# EAGLE design Airbeamv0_01-rn4020 (EAGLE 7.4.0)
DATABASE: ./BOM/Airbeam-PARTSDB.csv
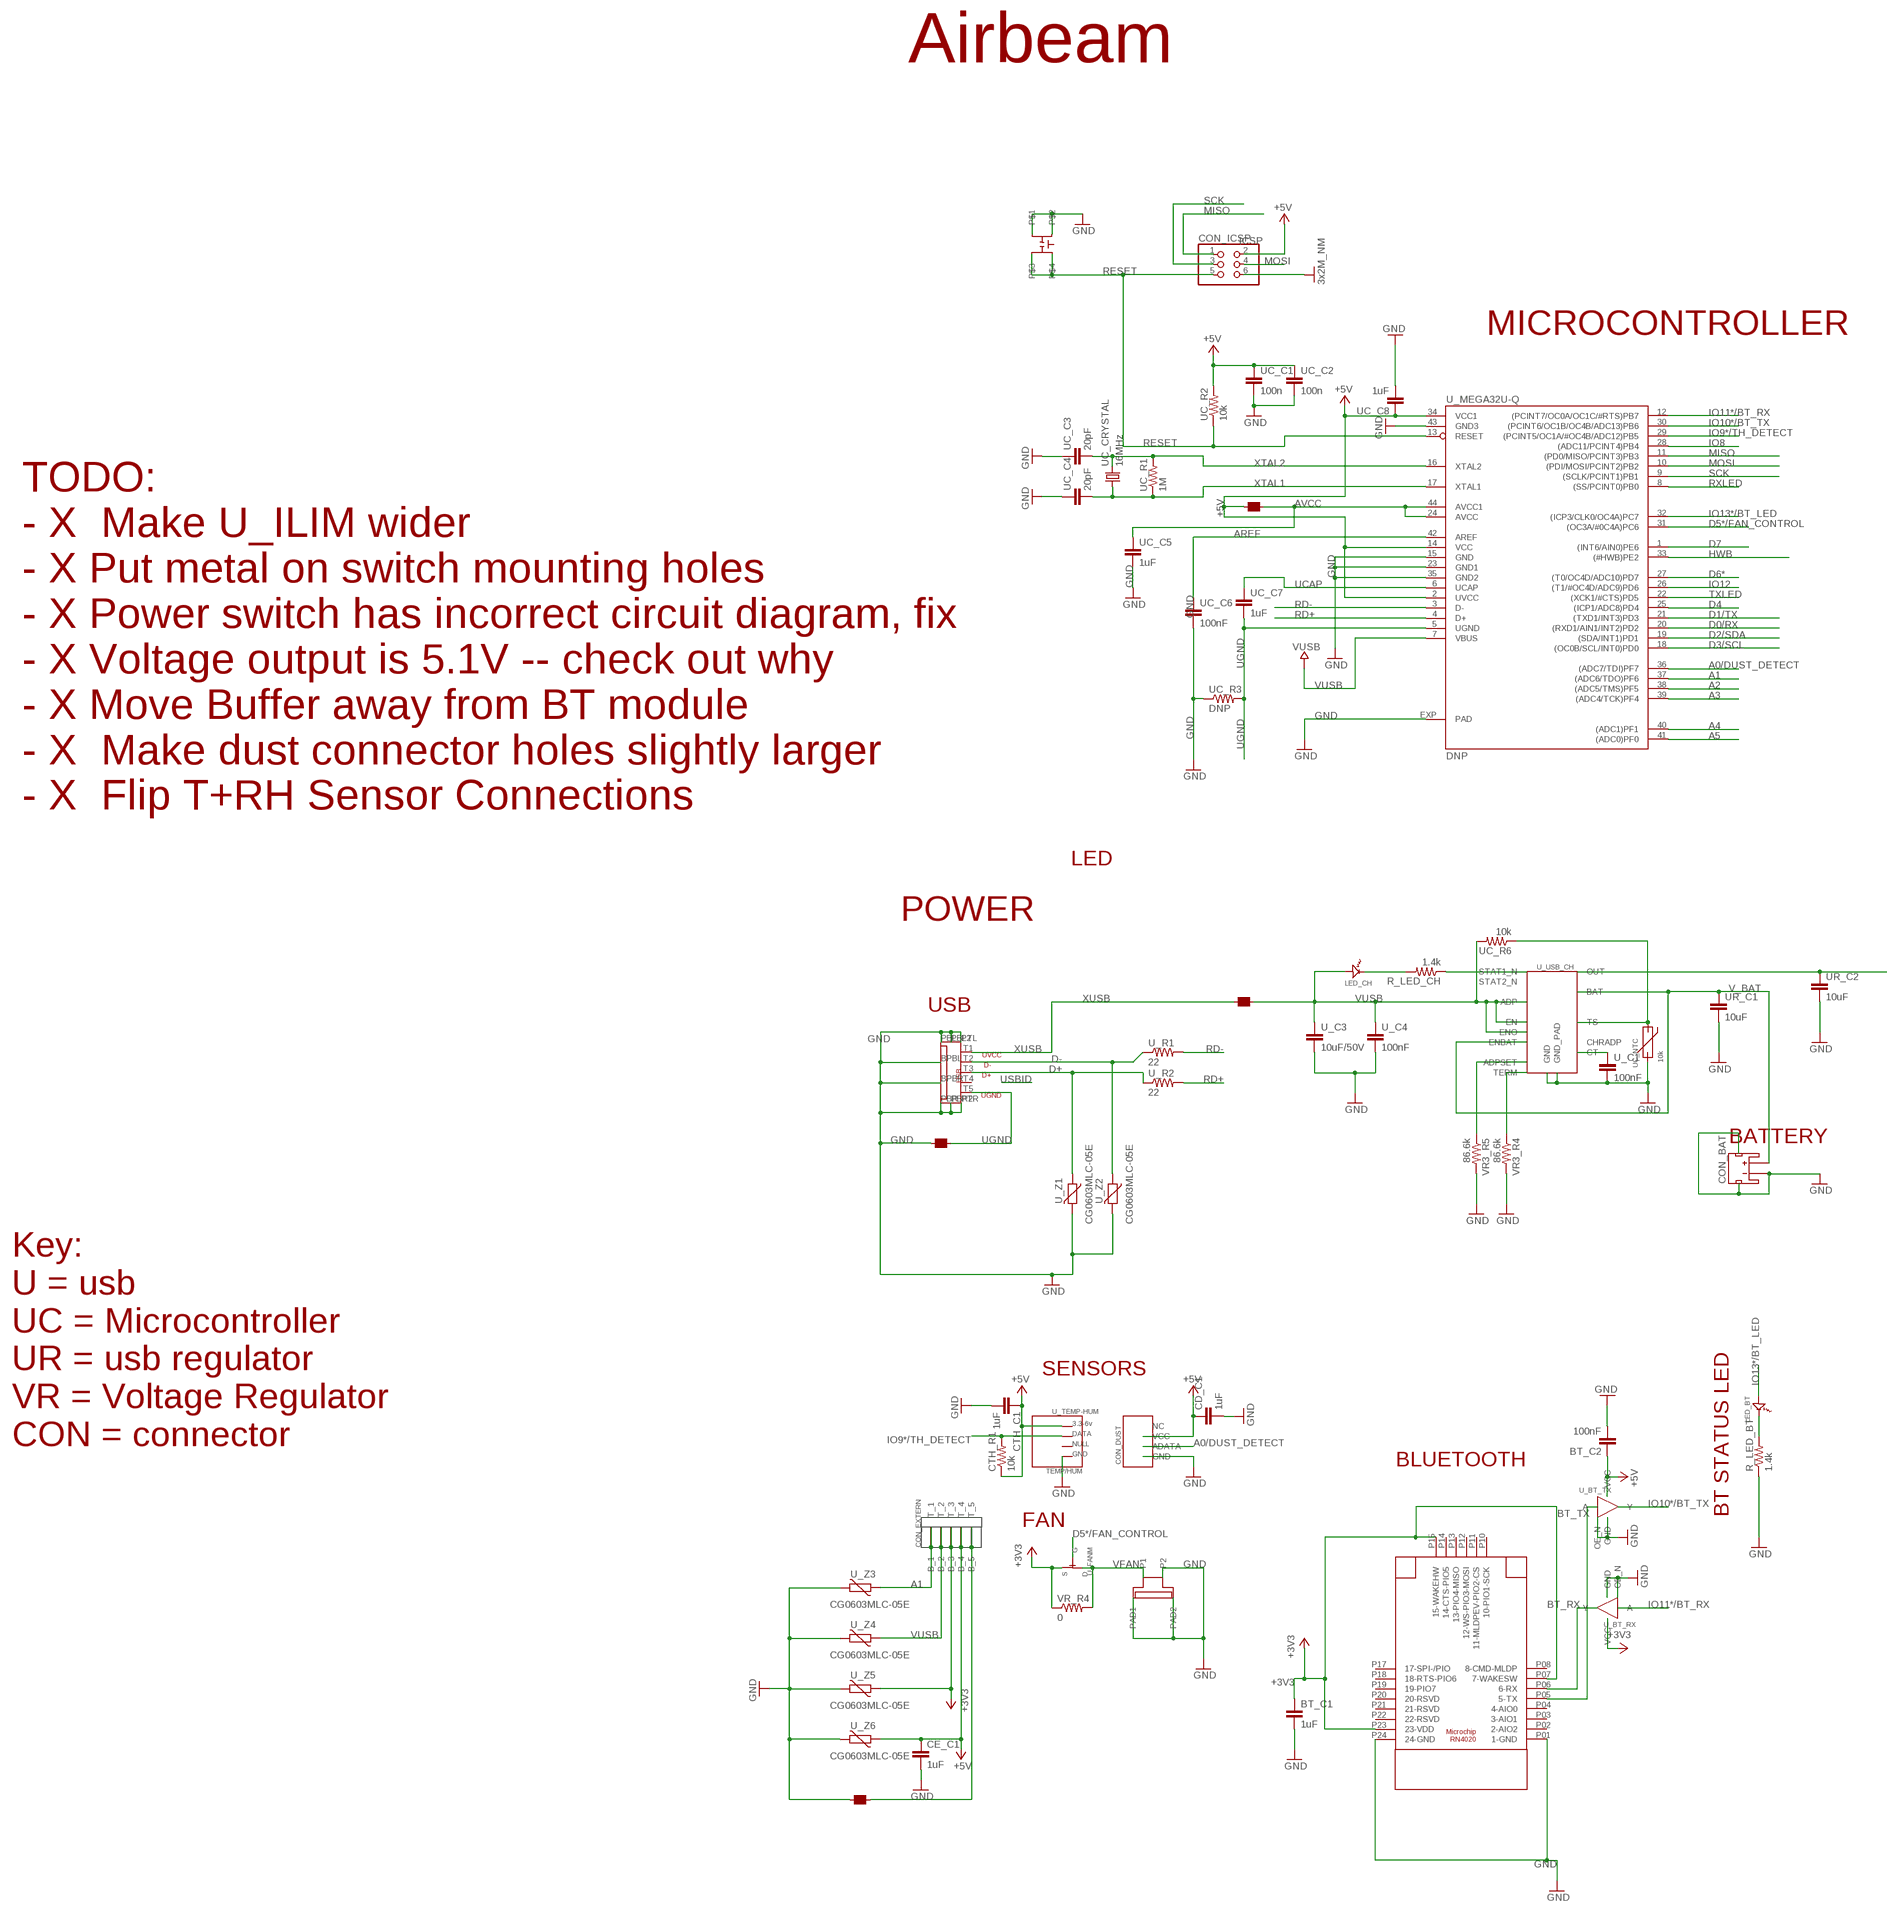
[diagram p0: schematic, sheet 1, part 1 of 2]
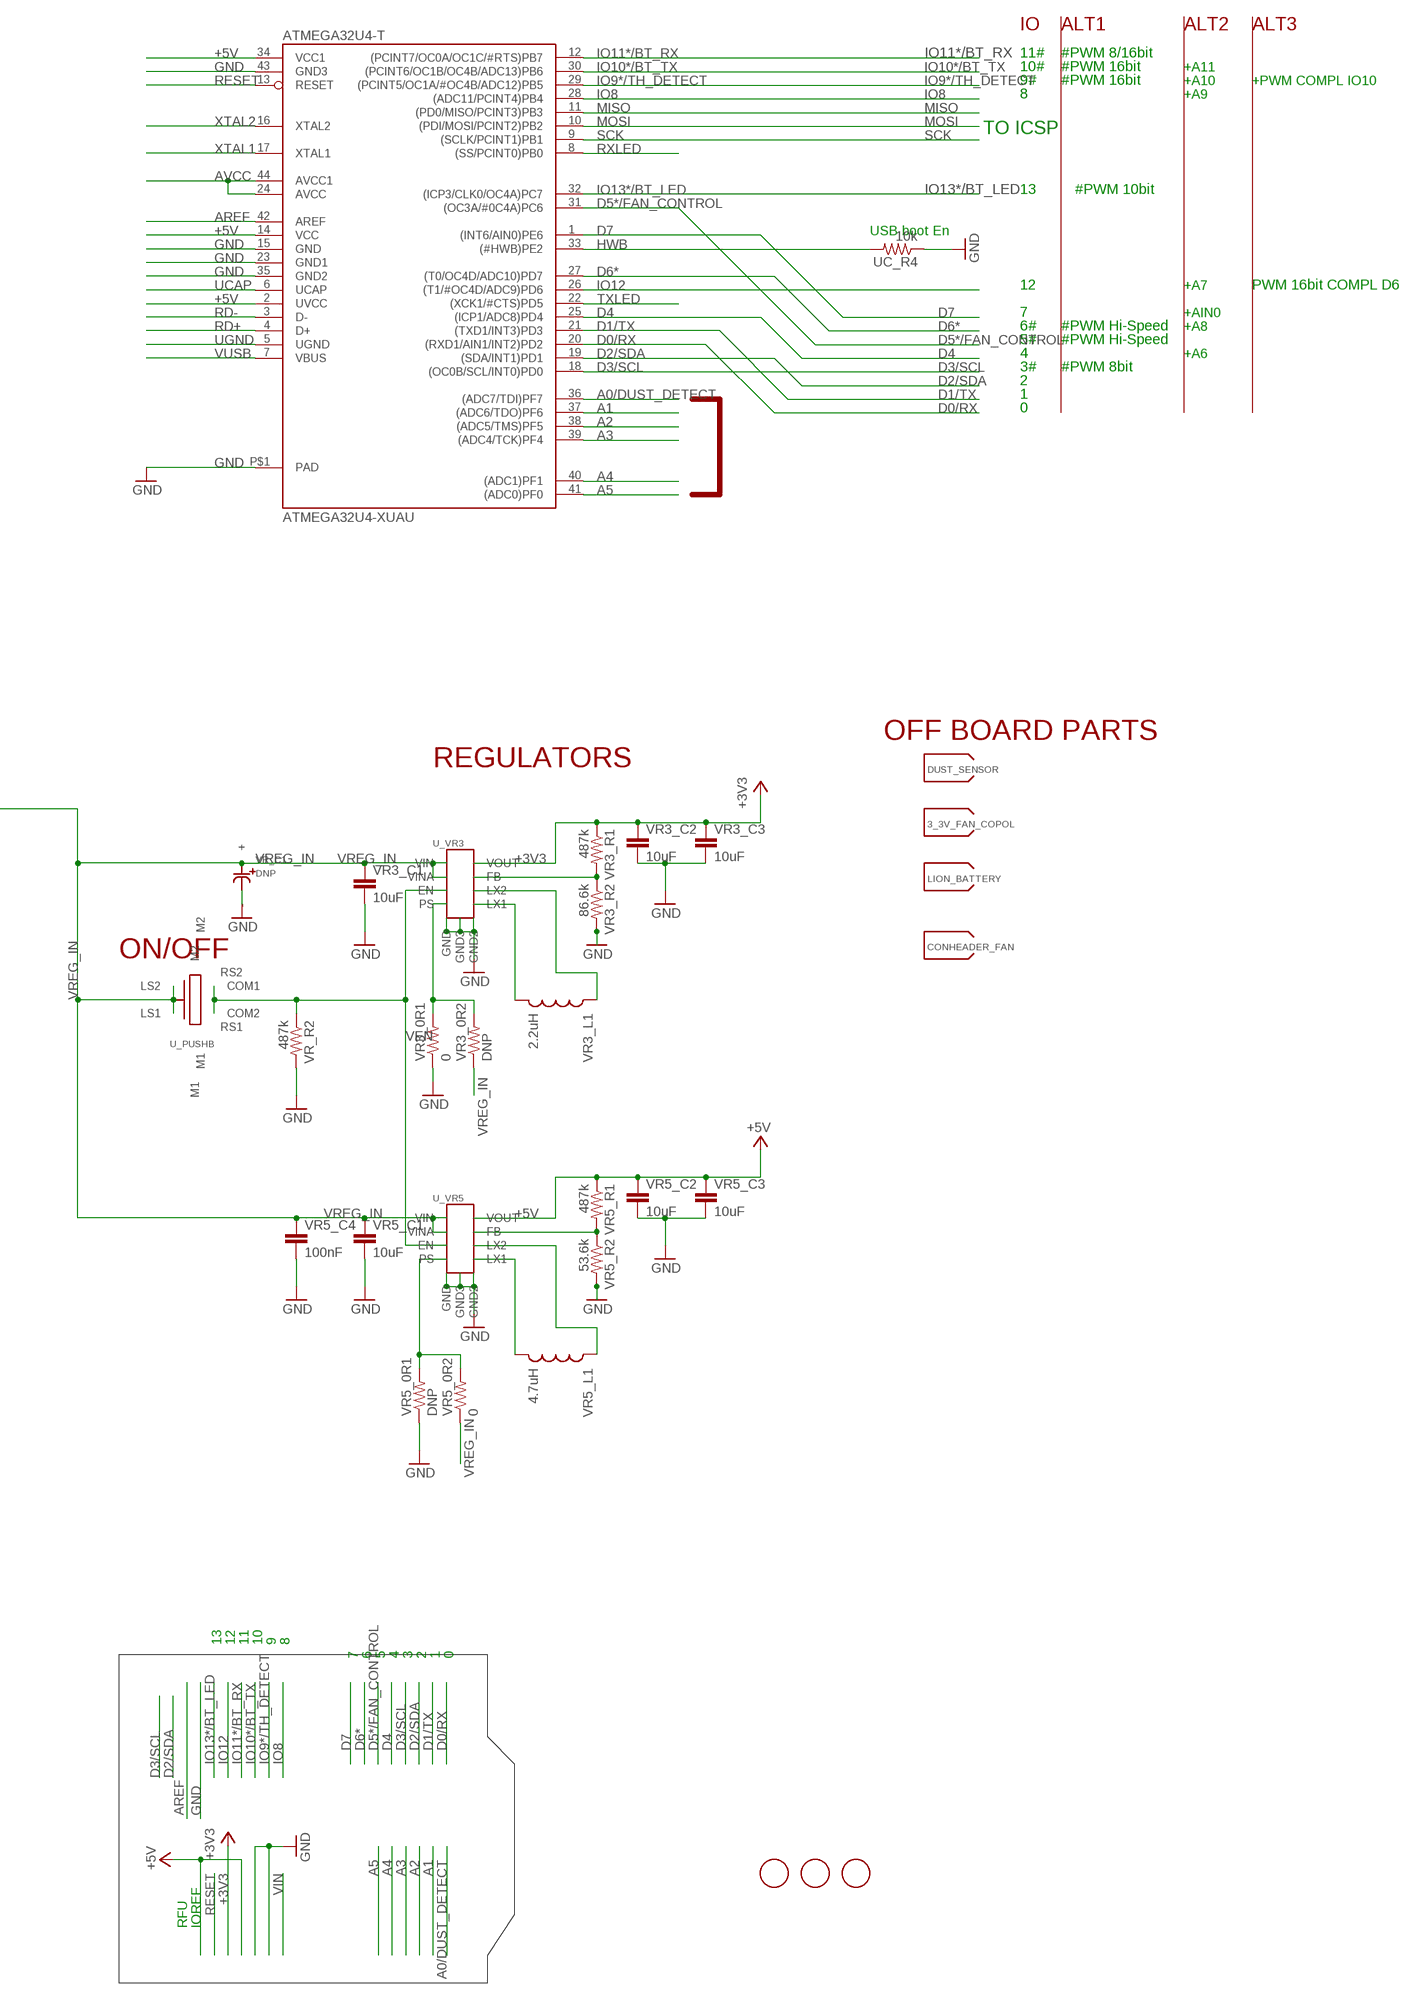
[diagram p1: schematic, sheet 1, part 2 of 2]

## Parts
3_3V_FAN_COPOL  OFF_BOARD  PART_OFFBOARD  [EMPTY]
ATMEGA32U4-T  ATMEGA32U4-XUAU  [TQFP44-PAD]
BT_C1  1uF  CAP0603-CAP  [0603-CAP]
BT_C2  100nF  CAP0603-CAP  [0603-CAP]
CA_FB1  FERITE_BEAD  [U_FB1]
CD_C1  1uF  CAP0603-CAP  [0603-CAP]
CE_C1  1uF  CAP0603-CAP  [0603-CAP]
CON_BAT  CON_BAT  JST_2MM_MALE  [JST-2-SMD]
CON_DUST  CON_DUST  [S4B-EH]
CON_EXTERN  TBLOCK_5  [TBLOCK_5]
CON_FAN  SUR_2PIN  [JST-0.8MM]
CON_ICSP  ICSP  PINHD-2X3  [2X03]
CON_USB  USB-FCI  [USB-FCI]
CONHEADER_FAN  OFF_BOARD  PART_OFFBOARD  [EMPTY]
CTH_C1  1uF  CAP0603-CAP  [0603-CAP]
CTH_R1  10k  RESISTOR0603-RES  [0603-RES]
DUST_SENSOR  OFF_BOARD  PART_OFFBOARD  [EMPTY]
FID1  FIDUCIALMOUNT  [FIDUCIA-MOUNT]
FID2  FIDUCIALMOUNT  [FIDUCIA-MOUNT]
FID3  FIDUCIALMOUNT  [FIDUCIA-MOUNT]
LED_BT  LED  [LED_550]
LED_CH  LED  [LED_550]
LION_BATTERY  OFF_BOARD  PART_OFFBOARD  [EMPTY]
R_LED_BT  1.4k  RESISTOR0603-RES  [0603-RES]
R_LED_CH  1.4k  RESISTOR0603-RES  [0603-RES]
RESET_SWITCH  DNP  SWITCH  [SWITCH_TACTILE]
U$1  RN4020  [RN4020SMD]
U_BT_RX  V_BUFFER  [SOT23-5]
U_BT_TX  V_BUFFER  [SOT23-5]
U_C1  100nF  CAP0603-CAP  [0603-CAP]
U_C3  10uF/50V  CAP1206  [1206]
U_C4  100nF  CAP0603-CAP  [0603-CAP]
U_FANM  DNP  MOSFET-N  [SOT23]
U_FB1  FERITE_BEAD  [U_FB1]
U_FB2  FERITE_BEAD  [U_FB1]
U_FB3  FERITE_BEAD  [U_FB1]
U_MEGA32U-Q  DNP  ATMEGA32U4-XUMU  [QFN44ML7X7]
U_PUSHB  PUSHBUTTON  [PUSHBUTTON]
U_R1  22  RESISTOR0603-RES  [0603-RES]
U_R2  22  RESISTOR0603-RES  [0603-RES]
U_TEMP-HUM  RHT03  [RHT03]
U_USB_CH  USB-BATTERY_LOAD  [TDFN33-14]
U_VR3  VREG-RTEC6150  [WFDFN-10]
U_VR5  VREG-RTEC6150  [WFDFN-10]
U_Z1  CG0603MLC-05E  VARISTORCN0603  [CT/CN0603]
U_Z2  CG0603MLC-05E  VARISTORCN0603  [CT/CN0603]
U_Z3  CG0603MLC-05E  VARISTORCN0603  [CT/CN0603]
U_Z4  CG0603MLC-05E  VARISTORCN0603  [CT/CN0603]
U_Z5  CG0603MLC-05E  VARISTORCN0603  [CT/CN0603]
U_Z6  CG0603MLC-05E  VARISTORCN0603  [CT/CN0603]
UC_C1  100n  CAP0603-CAP  [0603-CAP]
UC_C2  100n  CAP0603-CAP  [0603-CAP]
UC_C3  20pF  CAP0603-CAP  [0603-CAP]
UC_C4  20pF  CAP0603-CAP  [0603-CAP]
UC_C5  1uF  CAP0603-CAP  [0603-CAP]
UC_C6  100nF  CAP0603-CAP  [0603-CAP]
UC_C7  1uF  CAP0603-CAP  [0603-CAP]
UC_C8  1uF  CAP0603-CAP  [0603-CAP]
UC_CRYSTAL  16MHz  CRYSTALSMD  [HC49UP]
UC_NTC  10k  THERMISTOR0402  [0402]
UC_R1  1M  RESISTOR0603-RES  [0603-RES]
UC_R2  10k  RESISTOR0603-RES  [0603-RES]
UC_R3  DNP  RESISTOR0603-RES  [0603-RES]
UC_R4  10k  RESISTOR0603-RES  [0603-RES]
UC_R6  10k  RESISTOR0603-RES  [0603-RES]
UR_C1  10uF  CAP0805  [0805]
UR_C2  10uF  CAP0805  [0805]
VR3_0R1  0  RESISTOR0603-RES  [0603-RES]
VR3_0R2  DNP  RESISTOR0603-RES  [0603-RES]
VR3_C1  10uF  CAP0805  [0805]
VR3_C2  10uF  CAP0805  [0805]
VR3_C3  10uF  CAP0805  [0805]
VR3_L1  2.2uH  INDUCTOR1210  [1210]
VR3_R1  487k  RESISTOR0603  [0603-RES]
VR3_R2  86.6k  RESISTOR0603  [0603-RES]
VR3_R4  86.6k  RESISTOR0603  [0603-RES]
VR3_R5  86.6k  RESISTOR0603  [0603-RES]
VR5_0R1  DNP  RESISTOR0603-RES  [0603-RES]
VR5_0R2  0  RESISTOR0603-RES  [0603-RES]
VR5_C1  10uF  CAP0805  [0805]
VR5_C2  10uF  CAP0805  [0805]
VR5_C3  10uF  CAP0805  [0805]
VR5_C4  100nF  CAP0603-CAP  [0603-CAP]
VR5_L1  4.7uH  INDUCTOR1210  [1210]
VR5_R1  487k  RESISTOR0603  [0603-RES]
VR5_R2  53.6k  RESISTOR0603  [0603-RES]
VR_C1  DNP  CAP_POL120UF  [2917_CAP]
VR_R2  487k  RESISTOR0603  [0603-RES]
VR_R4  0  RESISTOR0603  [0603-RES]

## Nets
+3V3: BT_C1.1 CON_EXTERN.B_3 CON_EXTERN.T_3 U$1.P07(7-WAKESW) U$1.P15(15-WAKEHW) U$1.P23(23-VDD) U_BT_RX.5(VCC) U_FANM.2 U_VR3.P$1(VOUT) U_Z5.1 VR3_C2.1 VR3_C3.1 VR3_R1.1 VR_R4.1
+5V [usbvcc]: ATMEGA32U4-T.2(UVCC) ATMEGA32U4-T.14(VCC) ATMEGA32U4-T.34(VCC1) BT_C2.1 CD_C1.1 CE_C1.1 CON_DUST.P$3(VCC) CON_EXTERN.B_4 CON_EXTERN.T_4 CON_ICSP.2 CTH_C1.1 CTH_R1.1 U_BT_TX.5(VCC) U_FB2.P$1 U_MEGA32U-Q.2(UVCC) U_MEGA32U-Q.14(VCC) U_MEGA32U-Q.34(VCC1) U_TEMP-HUM.P$1 U_VR5.P$1(VOUT) U_Z6.1 UC_C1.1 UC_C2.1 UC_C8.1 UC_R2.2 VR5_C2.1 VR5_C3.1 VR5_R1.1
A0/DUST_DETECT: ATMEGA32U4-T.36((ADC7/TDI)PF7) CON_DUST.P$2(ADATA) U_MEGA32U-Q.36((ADC7/TDI)PF7)
A1: ATMEGA32U4-T.37((ADC6/TDO)PF6) CON_EXTERN.B_1 CON_EXTERN.T_1 U_MEGA32U-Q.37((ADC6/TDO)PF6) U_Z3.1
A2: ATMEGA32U4-T.38((ADC5/TMS)PF5) U_MEGA32U-Q.38((ADC5/TMS)PF5)
A3: ATMEGA32U4-T.39((ADC4/TCK)PF4) U_MEGA32U-Q.39((ADC4/TCK)PF4)
A4: ATMEGA32U4-T.40((ADC1)PF1) U_MEGA32U-Q.40((ADC1)PF1)
A5: ATMEGA32U4-T.41((ADC0)PF0) U_MEGA32U-Q.41((ADC0)PF0)
AREF [aref]: ATMEGA32U4-T.42(AREF) U_MEGA32U-Q.42(AREF) UC_C6.1
AVCC: ATMEGA32U4-T.24(AVCC) ATMEGA32U4-T.44(AVCC1) U_FB2.P$2 U_MEGA32U-Q.24(AVCC) U_MEGA32U-Q.44(AVCC1) UC_C5.1
BT_RX: U$1.P06(6-RX) U_BT_RX.4(Y)
BT_TX: U$1.P05(5-TX) U_BT_TX.2(A)
D0/RX: ATMEGA32U4-T.20((RXD1/AIN1/INT2)PD2) U_MEGA32U-Q.20((RXD1/AIN1/INT2)PD2)
D1/TX: ATMEGA32U4-T.21((TXD1/INT3)PD3) U_MEGA32U-Q.21((TXD1/INT3)PD3)
D2/SDA: ATMEGA32U4-T.19((SDA/INT1)PD1) U_MEGA32U-Q.19((SDA/INT1)PD1)
D3/SCL: ATMEGA32U4-T.18((OC0B/SCL/INT0)PD0) U_MEGA32U-Q.18((OC0B/SCL/INT0)PD0)
D4: ATMEGA32U4-T.25((ICP1/ADC8)PD4) U_MEGA32U-Q.25((ICP1/ADC8)PD4)
D5*/FAN_CONTROL: ATMEGA32U4-T.31((OC3A/#0C4A)PC6) U_FANM.1 U_MEGA32U-Q.31((OC3A/#0C4A)PC6)
D6*: ATMEGA32U4-T.27((T0/OC4D/ADC10)PD7) U_MEGA32U-Q.27((T0/OC4D/ADC10)PD7)
D7: ATMEGA32U4-T.1((INT6/AIN0)PE6) U_MEGA32U-Q.1((INT6/AIN0)PE6)
D+: CON_USB.T3 U_R2.1 U_Z1.1
D-: CON_USB.T2 U_R1.1 U_Z2.1
GND [gnd]: ATMEGA32U4-T.15(GND) ATMEGA32U4-T.23(GND1) ATMEGA32U4-T.35(GND2) ATMEGA32U4-T.43(GND3) ATMEGA32U4-T.P$1(PAD) BT_C1.2 BT_C2.2 CA_FB1.P$1 CD_C1.2 CE_C1.2 CON_BAT.1(-) CON_BAT.NC1(PAD1) CON_BAT.NC2(PAD2) CON_DUST.P$1(GND) CON_FAN.P2 CON_FAN.PAD1 CON_FAN.PAD2 CON_ICSP.6 CON_USB.BPBL CON_USB.BPBR CON_USB.PBL CON_USB.PBL2 CON_USB.PBR CON_USB.PBR2 CON_USB.PTL CON_USB.PTR CTH_C1.2 R_LED_BT.1 RESET_SWITCH.P1 RESET_SWITCH.P2 U$1.P01(1-GND) U$1.P24(24-GND) U_BT_RX.1(OE_N) U_BT_RX.3(GND) U_BT_TX.1(OE_N) U_BT_TX.3(GND) U_C1.2 U_C3.2 U_C4.2 U_FB1.P$1 U_MEGA32U-Q.15(GND) U_MEGA32U-Q.23(GND1) U_MEGA32U-Q.35(GND2) U_MEGA32U-Q.43(GND3) U_MEGA32U-Q.EXP(PAD) U_TEMP-HUM.P$4 U_USB_CH.GND_PAD U_USB_CH.P$4(GND) U_VR3.MID_PAD(GND3) U_VR3.P$3(GND) U_VR3.P$9(GND2) U_VR5.MID_PAD(GND3) U_VR5.P$3(GND) U_VR5.P$9(GND2) U_Z1.2 U_Z2.2 U_Z3.2 U_Z4.2 U_Z5.2 U_Z6.2 UC_C1.2 UC_C2.2 UC_C3.1 UC_C4.1 UC_C5.2 UC_C6.2 UC_C8.2 UC_NTC.1 UC_R3.1 UC_R4.1 UR_C1.2 UR_C2.2 VR3_0R1.1 VR3_C1.2 VR3_C2.2 VR3_C3.2 VR3_R2.2 VR3_R4.2 VR3_R5.2 VR5_0R1.1 VR5_C1.2 VR5_C2.2 VR5_C3.2 VR5_C4.2 VR5_R2.2 VR_C1.T-(-) VR_R2.2 ; supply symbol labelled 3x2M_NM
HWB: ATMEGA32U4-T.33((#HWB)PE2) U_MEGA32U-Q.33((#HWB)PE2) UC_R4.2
IO8: ATMEGA32U4-T.28((ADC11/PCINT4)PB4) U_MEGA32U-Q.28((ADC11/PCINT4)PB4)
IO9*/TH_DETECT: ATMEGA32U4-T.29((PCINT5/OC1A/#OC4B/ADC12)PB5) CTH_R1.2 U_MEGA32U-Q.29((PCINT5/OC1A/#OC4B/ADC12)PB5) U_TEMP-HUM.P$2
IO10*/BT_TX: ATMEGA32U4-T.30((PCINT6/OC1B/OC4B/ADC13)PB6) U_BT_TX.4(Y) U_MEGA32U-Q.30((PCINT6/OC1B/OC4B/ADC13)PB6)
IO11*/BT_RX: ATMEGA32U4-T.12((PCINT7/OC0A/OC1C/#RTS)PB7) U_BT_RX.2(A) U_MEGA32U-Q.12((PCINT7/OC0A/OC1C/#RTS)PB7)
IO12: ATMEGA32U4-T.26((T1/#OC4D/ADC9)PD6) U_MEGA32U-Q.26((T1/#OC4D/ADC9)PD6)
IO13*/BT_LED: ATMEGA32U4-T.32((ICP3/CLK0/OC4A)PC7) LED_BT.ANODE(AN) U_MEGA32U-Q.32((ICP3/CLK0/OC4A)PC7)
MISO: ATMEGA32U4-T.11((PD0/MISO/PCINT3)PB3) CON_ICSP.1 U_MEGA32U-Q.11((PD0/MISO/PCINT3)PB3)
MOSI: ATMEGA32U4-T.10((PDI/MOSI/PCINT2)PB2) CON_ICSP.4 U_MEGA32U-Q.10((PDI/MOSI/PCINT2)PB2)
N$1: U_VR3.P$2(LX2) VR3_L1.1
N$2: U_USB_CH.P$10(TERM) VR3_R4.1
N$3: LED_BT.CATHODE(CATH) R_LED_BT.2
N$4: U_VR3.P$10(FB) VR3_R1.2 VR3_R2.1
N$5: U_USB_CH.P$11(TS) UC_NTC.2 UC_R6.1
N$6: U_C1.1 U_USB_CH.P$14(CT)
N$7 [gnd]: CA_FB1.P$2 CON_EXTERN.B_5 CON_EXTERN.T_5
N$8: R_LED_CH.1 U_USB_CH.P$3(STAT1_N)
N$9: U_VR3.P$4(LX1) VR3_L1.2
N$10: U_VR5.P$10(FB) VR5_R1.2 VR5_R2.1
N$11: U_VR5.P$2(LX2) VR5_L1.1
N$12: U_VR5.P$4(LX1) VR5_L1.2
N$14: LED_CH.CATHODE(CATH) R_LED_CH.2
N$15: U_USB_CH.P$1(ADPSET) VR3_R5.1
RD+: ATMEGA32U4-T.4(D+) U_MEGA32U-Q.4(D+) U_R2.2
RD-: ATMEGA32U4-T.3(D-) U_MEGA32U-Q.3(D-) U_R1.2
RESET: ATMEGA32U4-T.13(RESET) CON_ICSP.5 RESET_SWITCH.P3 RESET_SWITCH.P4 U_MEGA32U-Q.13(RESET) UC_R2.1
RXLED: ATMEGA32U4-T.8((SS/PCINT0)PB0) U_MEGA32U-Q.8((SS/PCINT0)PB0)
SCK: ATMEGA32U4-T.9((SCLK/PCINT1)PB1) CON_ICSP.3 U_MEGA32U-Q.9((SCLK/PCINT1)PB1)
TXLED: ATMEGA32U4-T.22((XCK1/#CTS)PD5) U_MEGA32U-Q.22((XCK1/#CTS)PD5)
UCAP: ATMEGA32U4-T.6(UCAP) U_MEGA32U-Q.6(UCAP) UC_C7.1
UGND [gnd]: ATMEGA32U4-T.5(UGND) CON_USB.T5 U_FB1.P$2 U_MEGA32U-Q.5(UGND) UC_C7.2 UC_R3.2
V_BAT: CON_BAT.2(+) U_USB_CH.P$8(ENBAT) U_USB_CH.P$12(BAT) UR_C1.1
VEN: U_PUSHB.C1(COM1) U_PUSHB.C2(COM2) U_VR3.P$6(EN) U_VR5.P$6(EN) VR_R2.1
VFAN: CON_FAN.P1 U_FANM.3 VR_R4.2
VR3_PS [gnd]: U_VR3.P$7(PS) VR3_0R1.2 VR3_0R2.2
VR5_PS [gnd]: U_VR5.P$7(PS) VR5_0R1.2 VR5_0R2.2
VREG_IN: U_PUSHB.LS1 U_PUSHB.LS2 U_USB_CH.P$13(OUT) U_VR3.P$5(VIN) U_VR3.P$8(VINA) U_VR5.P$5(VIN) U_VR5.P$8(VINA) UR_C2.1 VR3_0R2.1 VR3_C1.1 VR5_0R2.1 VR5_C1.1 VR5_C4.1 VR_C1.T+(+)
VUSB [usbvcc]: ATMEGA32U4-T.7(VBUS) CON_EXTERN.B_2 CON_EXTERN.T_2 LED_CH.ANODE(AN) U_C3.1 U_C4.1 U_FB3.P$2 U_MEGA32U-Q.7(VBUS) U_USB_CH.P$2(ADP) U_USB_CH.P$6(EN) U_USB_CH.P$7(ENO) U_Z4.1 UC_R6.2
XTAL1: ATMEGA32U4-T.17(XTAL1) U_MEGA32U-Q.17(XTAL1) UC_C4.2 UC_CRYSTAL.1 UC_R1.1
XTAL2: ATMEGA32U4-T.16(XTAL2) U_MEGA32U-Q.16(XTAL2) UC_C3.2 UC_CRYSTAL.2 UC_R1.2
XUSB [usbvcc]: CON_USB.T1 U_FB3.P$1
Unconnected: CON_DUST.P$4(NC) CON_USB.T4 U$1.P02(2-AIO2) U$1.P03(3-AIO1) U$1.P04(4-AIO0) U$1.P08(8-CMD-MLDP) U$1.P10(10-PIO1-SCK) U$1.P11(11-MLDPEV-PIO2-CS) U$1.P12(12-WS-PIO3-MOSI) U$1.P13(13-PIO4-MISO) U$1.P14(14-CTS-PIO5) U$1.P17(17-SPI-/PIO) U$1.P18(18-RTS-PIO6) U$1.P19(19-PIO7) U$1.P20(20-RSVD) U$1.P21(21-RSVD) U$1.P22(22-RSVD) U_PUSHB.M1 U_PUSHB.M2 U_PUSHB.RS1 U_PUSHB.RS2 U_TEMP-HUM.P$3 U_USB_CH.P$5(STAT2_N) U_USB_CH.P$9(CHRADP)

## Notes on the sheet
- Airbeam
- MICROCONTROLLER
- IO | ALT1 | ALT2 | ALT3
- 11# | #PWM 8/16bit
- 10# | #PWM 16bit | +A11
- 9# | #PWM 16bit | +A10 | +PWM COMPL IO10
- 8 | +A9
- TO ICSP
- 13 | #PWM 10bit
- USB boot En
- 12 | +A7 | PWM 16bit COMPL D6
- 7 | +AIN0
- 6# | #PWM Hi-Speed | +A8
- 5# | #PWM Hi-Speed
- 4 | +A6
- 3# | #PWM 8bit
- 2
- 1
- 0
- TODO:
  - X  Make U_ILIM wider
  - X Put metal on switch mounting holes
  - X Power switch has incorrect circuit diagram, fix
  - X Voltage output is 5.1V -- check out why
  - X Move Buffer away from BT module
  - X  Make dust connector holes slightly larger
  - X  Flip T+RH Sensor Connections
- LED
- POWER | OFF BOARD PARTS
- REGULATORS
- USB
- ON/OFF
- BATTERY
- SENSORS
- Key:
  U = usb
  UC = Microcontroller
  UR = usb regulator
  VR = Voltage Regulator
  CON = connector
- BLUETOOTH
- BT STATUS LED
- FAN
- 13 | 12 | 11 | 10 | 9 | 8
- 7 | 6 | 5 | 4 | 3 | 2 | 1 | 0
- RFU | IOREF

## Library data of the parts
3_3V_FAN_COPOL = Airbeam:PART_OFFBOARD; PARTNO: F16FB-05LLC/E
ATMEGA32U4-T = SmartPrj:ATMEGA32U4-XU; PARTNO: ATMEGA32U4-AU
BT_C1 CD_C1 CE_C1 CTH_C1 UC_C5 UC_C7 UC_C8 = SparkFun-Passives:CAP: Capacitor Standard 0603 ceramic capacitor, and 0.1" leaded capacitor.; PARTNO: C1608X5R1C105K080AA
BT_C2 U_C1 UC_C1 UC_C2 UC_C6 VR5_C4 = SparkFun-Passives:CAP: Capacitor Standard 0603 ceramic capacitor, and 0.1" leaded capacitor.; PARTNO: C1608X7R1E104K080AA
CA_FB1 U_FB1-U_FB3 = Airbeam:FERITE_BEAD; PARTNO: MH2029-600Y
CON_BAT = SparkFun-Connectors:JST_2MM_MALE: Mates to single-cell LiPo batteries. CONN-08352; PARTNO: S2B-PH-SM4-TB(LF)(SN); PROD_ID: CONN-08352
CON_DUST = Airbeam:CON_DUST; PARTNO: S4B-EH
CON_EXTERN = Airbeam:TBLOCK_5; PARTNO: 1770911
CON_FAN = Airbeam:SUR_2PIN; PARTNO: SM02B-SURS-TF
CON_ICSP = SmartPrj:PINHD-2X3: PIN HEADER; PARTNO: 67997-206HLF
CON_USB = Airbeam:USB-FCI; PARTNO: 10103594-0001LF
CONHEADER_FAN = Airbeam:PART_OFFBOARD; PARTNO: 02SUR-32S
CTH_R1 UC_R2 UC_R4 UC_R6 = SparkFun-Passives:RESISTOR: Resistor Basic schematic elements and footprints for 0603, 1206, and PTH resistors.; PARTNO: RC0603JR-0710KL
DUST_SENSOR = Airbeam:PART_OFFBOARD; PARTNO: PPD60PV-T2
FID1-FID3 = SmartPrj:FIDUCIALMOUNT; PARTNO: DNP
LED_BT = Airbeam:LED; PARTNO: 550-1107F
LED_CH = Airbeam:LED; PARTNO: 550-1307F
LION_BATTERY = Airbeam:PART_OFFBOARD; PARTNO: 585460_2000mAh
R_LED_BT R_LED_CH = SparkFun-Passives:RESISTOR: Resistor Basic schematic elements and footprints for 0603, 1206, and PTH resistors.; PARTNO: RC0603FR-071K4L
RESET_SWITCH = Airbeam:SWITCH; PARTNO: TL3315NF250Q
U$1 = microchip_bluetooth_v101:RN4020
U_BT_RX U_BT_TX = Airbeam:V_BUFFER; PARTNO: SN74LVC1G125DBVR
U_C3 = SparkFun-Passives:CAP: Capacitor Standard 0603 ceramic capacitor, and 0.1" leaded capacitor.; PARTNO: CL31A106KBHNNNE
U_C4 = SparkFun-Passives:CAP: Capacitor Standard 0603 ceramic capacitor, and 0.1" leaded capacitor.; PARTNO: CC0603ZRY5V9BB104
U_FANM = Airbeam:MOSFET-N; PARTNO: NDS331N
U_MEGA32U-Q = SmartPrj:ATMEGA32U4-XU; PARTNO: ATMEGA32U4-MU
U_PUSHB = Airbeam:PUSHBUTTON; PARTNO: LC2259EENP
U_R1 U_R2 = SparkFun-Passives:RESISTOR: Resistor Basic schematic elements and footprints for 0603, 1206, and PTH resistors.; PARTNO: RC0603JR-0722RL
U_TEMP-HUM = Airbeam:RHT03; PARTNO: RHT03
U_USB_CH = Airbeam:USB-BATTERY_LOAD; PARTNO: AAT3672IWO-4.2-1-T1
U_VR3 U_VR5 = Airbeam:VREG-RTEC6150; PARTNO: RT6150BGQW
U_Z1-U_Z6 = varistor:VARISTOR: VARISTOR; PARTNO: CG0603MLC-05E
UC_C3 UC_C4 = SparkFun-Passives:CAP: Capacitor Standard 0603 ceramic capacitor, and 0.1" leaded capacitor.; PARTNO: CL10C200JB8NNNC
UC_CRYSTAL = SparkFun-FreqCtrl:CRYSTAL: Various standard crystals. Proven footprints. Spark Fun Electronics SKU : COM-00534; PARTNO: ECS-160-20-3X-TR
UC_NTC = Airbeam:THERMISTOR; PARTNO: ERT-J0EM103J
UC_R1 = SparkFun-Passives:RESISTOR: Resistor Basic schematic elements and footprints for 0603, 1206, and PTH resistors.; PARTNO: RC0603FR-071ML
UC_R3 VR3_0R1 VR3_0R2 VR5_0R1 VR5_0R2 = SparkFun-Passives:RESISTOR: Resistor Basic schematic elements and footprints for 0603, 1206, and PTH resistors.; PARTNO: RC0603JR-070RL
UR_C1 UR_C2 VR3_C1-VR3_C3 VR5_C1-VR5_C3 = SparkFun-Passives:CAP: Capacitor Standard 0603 ceramic capacitor, and 0.1" leaded capacitor.; PARTNO: C2012X5R1C106K085AC
VR3_L1 = SparkFun-Passives:INDUCTOR: Inductors Basic Inductor/Choke - 0603 and 1206. Footprints are not proven and vary greatly between part numbers. SRN6045- 33uH, 20% 1.4A SDR0403-560KL - 56uH, 10%, 500mA RMS/740mA peak; PARTNO: BRL3225T2R2M
VR3_R1 VR5_R1 VR_R2 = SparkFun-Resistors:RESISTOR: Resistor Basic schematic elements and footprints for 0603, 1206, and PTH resistors.; PARTNO: ERJ-3EKF4873V
VR3_R2 VR3_R4 VR3_R5 = SparkFun-Resistors:RESISTOR: Resistor Basic schematic elements and footprints for 0603, 1206, and PTH resistors.; PARTNO: ERJ-3EKF8662V
VR5_L1 = SparkFun-Passives:INDUCTOR: Inductors Basic Inductor/Choke - 0603 and 1206. Footprints are not proven and vary greatly between part numbers. SRN6045- 33uH, 20% 1.4A SDR0403-560KL - 56uH, 10%, 500mA RMS/740mA peak; PARTNO: CBC3225T4R7MR
VR5_R2 = SparkFun-Resistors:RESISTOR: Resistor Basic schematic elements and footprints for 0603, 1206, and PTH resistors.; PARTNO: RC0805FR-0753K6L
VR_C1 = Airbeam:CAP_POL; PARTNO: T491D107K010AT
VR_R4 = SparkFun-Resistors:RESISTOR: Resistor Basic schematic elements and footprints for 0603, 1206, and PTH resistors.; PARTNO: RC0603JR-070RL

## Net classes
0 default: width 0.152 mm, drill 0.33 mm, clearance 0.152 mm
1 power: width 0.152 mm, drill 0.33 mm, clearance 0.152 mm
2 gnd: width 0.152 mm, drill 0.33 mm, clearance 0.152 mm
3 usbvcc: width 0.152 mm, drill 0.33 mm, clearance 0.152 mm
4 aref: width 0.152 mm, drill 0.33 mm, clearance 0.152 mm

## Board
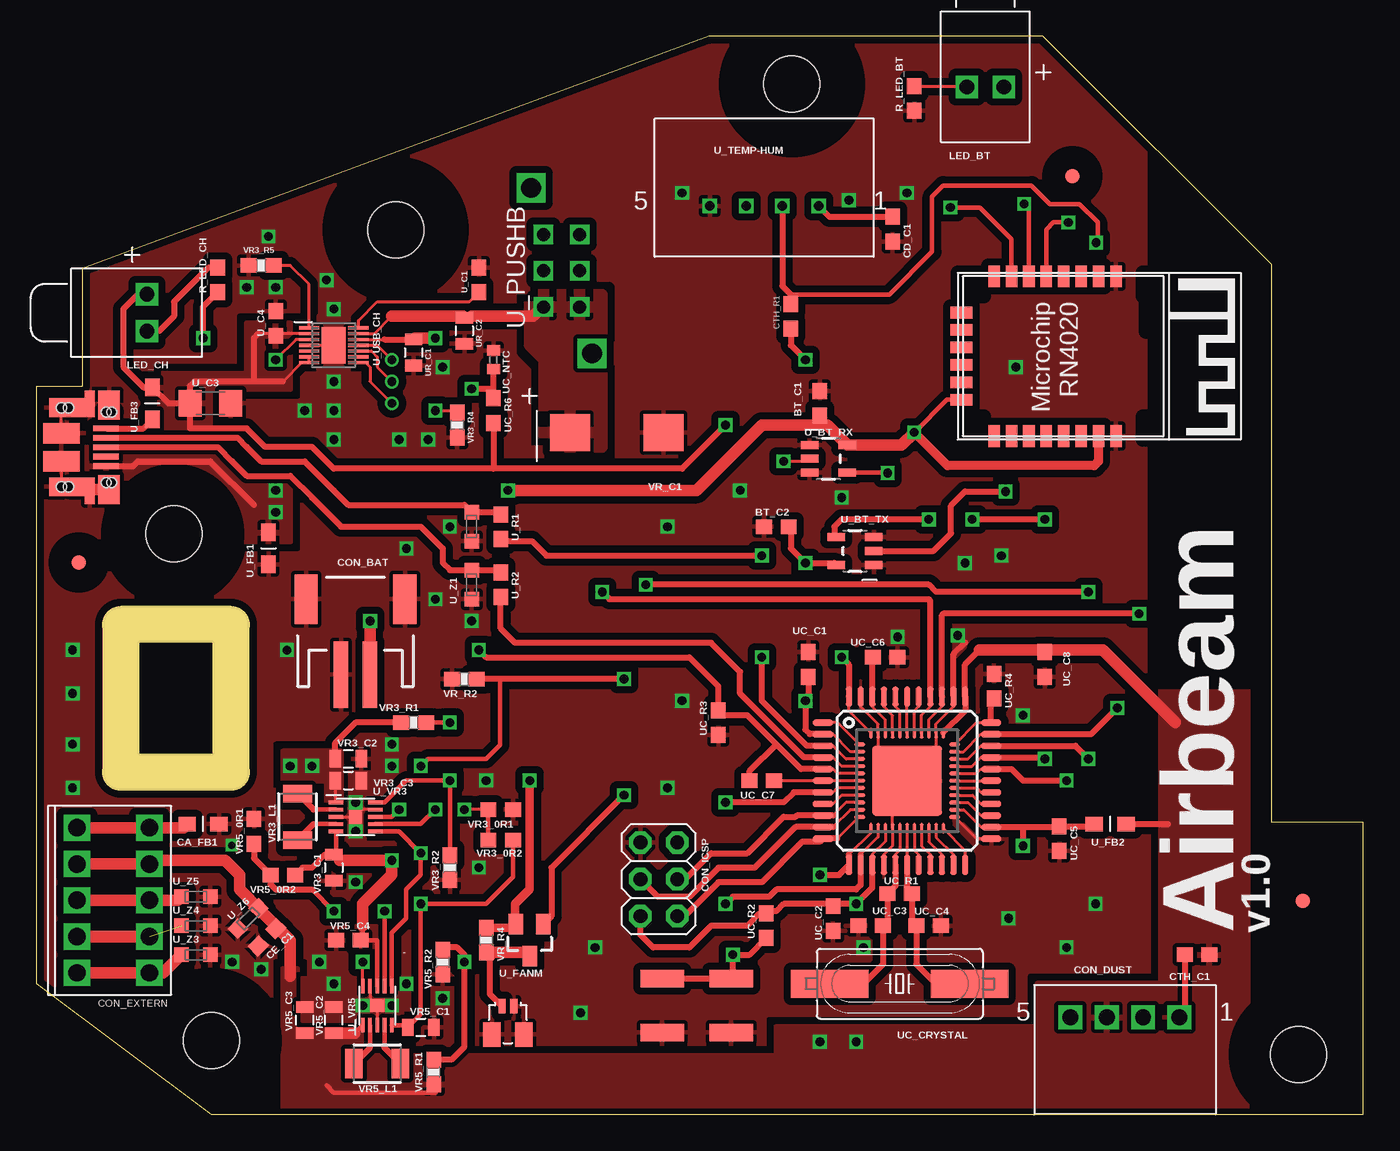
[diagram p2: board, top side]
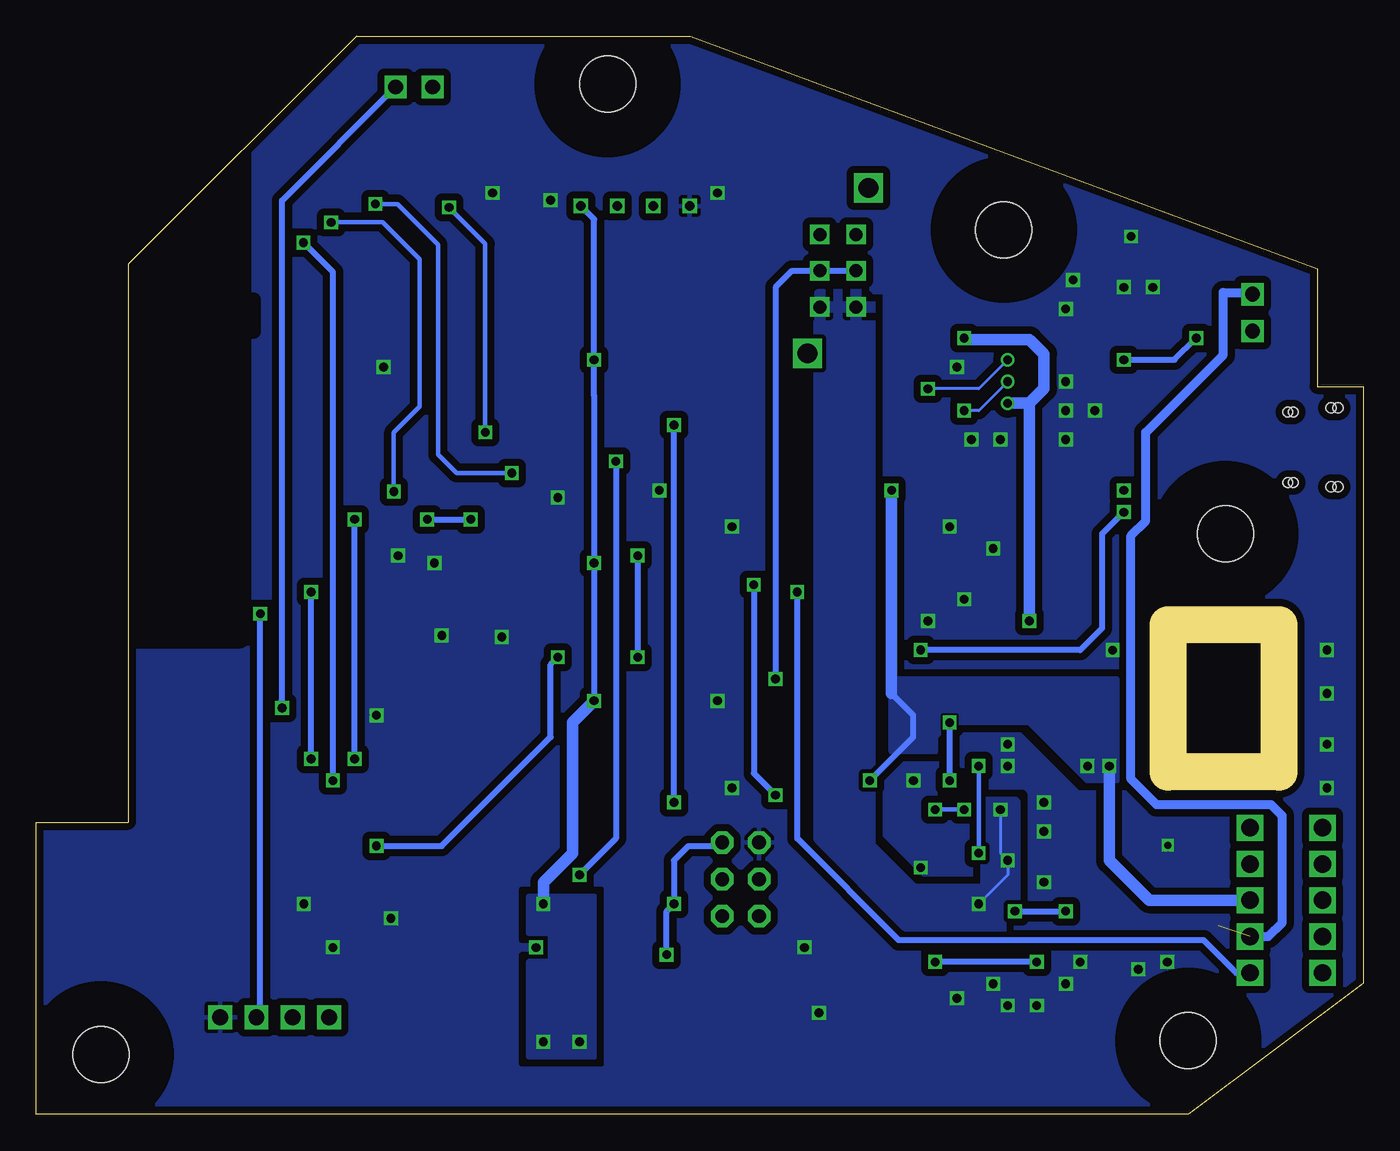
[diagram p3: board, bottom side, seen from below]

Size 91.44 x 74.3 mm. Coordinates in mm from the lower left corner, seen from the top.
Outline: 5.81,33.75 5.81,23.59 13.43,23.59 13.43,33.75 5.81,33.75
Outline: 0,9.02 12.06,0 91.44,0 91.44,20.12 85.09,20.12 85.09,58.58 69.38,74.3 46.35,74.3 3.17,58.29 3.17,50.16 0,50.16 0,9.02
Copper layers (1*16): Top 0.0356mm / dielectric 1.5011mm / Bottom 0.0356mm
Design rules "LaenPCBOrder *": minimum track width 6mil, minimum drill 13mil, track to track 6mil, track to pad 6mil, pad to pad 6mil, via to via 6mil, smd to smd 6mil, copper to edge 15mil, drill to drill 6mil, minimum pad ring 7mil, minimum via ring 7mil, stop-mask expansion 3mil, vias tented up to drill 0mil, thermal gap 10mil
Holes 3.86 mm at 9.5,40 12.06,5.08 24.77,60.96 52.07,70.99 87,4.13
tRestrict: area 5.4,35.9 to 13.6,44.1; area 20.6,56.8 to 28.9,65.1; area 47.9,66.9 to 56.2,75.1; area 82.9,0 to 91.1,8.3; area 7.9,1 to 16.2,9.2; area 77.5,30 to 86.5,67
bRestrict: area 5.4,35.9 to 13.6,44.1; area 20.6,56.8 to 28.9,65.1; area 47.9,66.9 to 56.2,75.1; area 82.9,0 to 91.1,8.3; area 7.9,1 to 16.2,9.2; area 77.5,33 to 86.5,67
vRestrict: area 42.5,38.6 to 43.1,38.9; area 35.8,35.2 to 36.4,35.7; area 44.5,35.2 to 45.2,35.7; area 41.3,35.2 to 41.8,35.7

### Footprints (pad centres in the part's own frame; a part is rotated, then mirrored left to right if it is on the bottom)
TQFP44-PAD = smd 1.4 x 0.45: 1 -5.8,4; 2 -5.8,3.2; 3 -5.8,2.4; 4 -5.8,1.6; 5 -5.8,0.8; 6 -5.8,0; 7 -5.8,-0.8; 8 -5.8,-1.6; 9 -5.8,-2.4; 10 -5.8,-3.2; 11 -5.8,-4; 23 5.8,-4; 24 5.8,-3.2; 25 5.8,-2.4; 26 5.8,-1.6; 27 5.8,-0.8; 28 5.8,0; 29 5.8,0.8; 30 5.8,1.6; 31 5.8,2.4; 32 5.8,3.2; 33 5.8,4 | smd 0.45 x 1.4: 12 -4,-5.8; 13 -3.2,-5.8; 14 -2.4,-5.8; 15 -1.6,-5.8; 16 -0.8,-5.8; 17 0,-5.8; 18 0.8,-5.8; 19 1.6,-5.8; 20 2.4,-5.8; 21 3.2,-5.8; 22 4,-5.8; 34 4,5.8; 35 3.2,5.8; 36 2.4,5.8; 37 1.6,5.8; 38 0.8,5.8; 39 0,5.8; 40 -0.8,5.8; 41 -1.6,5.8; 42 -2.4,5.8; 43 -3.2,5.8; 44 -4,5.8 | smd 1 x 1: P$1 0,0
0603-CAP = smd 1.1 x 1: 1 -0.85,0; 2 0.85,0
U_FB1 = smd 1.2 x 1: P$1 -1.1,0; P$2 1.1,0
JST-2-SMD = smd 1 x 4.6: 1 -1,-3.7; 2 1,-3.7 | smd 1.6 x 3.4: NC1 -3.4,1.5; NC2 3.4,1.5
S4B-EH = drill 1.1 square: P$1 -3.75,0; P$2 -1.25,0; P$3 1.25,0; P$4 3.75,0
TBLOCK_5 = drill 1.2 square: B_1 -5,-2.5; B_2 -2.5,-2.5; B_3 0,-2.5; B_4 2.5,-2.5; B_5 5,-2.5; T_1 -5,2.5; T_2 -2.5,2.5; T_3 0,2.5; T_4 2.5,2.5; T_5 5,2.5
JST-0.8MM = smd 0.5 x 1: P1 -0.4,1.95; P2 0.4,1.95 | smd 1.2 x 1.7: PAD1 -1.1,0; PAD2 1.1,0
2X03 = drill 0.95 pad 1.55 octagon: 1 -2.54,-1.27; 2 -2.54,1.27; 3 0,-1.27; 4 0,1.27; 5 2.54,-1.27; 6 2.54,1.27
USB-FCI = smd 1.425 x 2.5: BPBL 0.963,-1.25; BPBR -0.963,-1.25 | smd 1.3 x 2.45: PBL 2.725,-1.625; PBR -2.725,-1.625 | smd 1.825 x 0.7: PBL2 2.987,-3.2; PBR2 -2.987,-3.2 | smd 2 x 1.46: PTL 2.9,-4.53; PTR -2.9,-4.53 | smd 0.4 x 1.75: T1 1.3,-4.325; T2 0.65,-4.325; T3 0,-4.325; T4 -0.65,-4.325; T5 -1.3,-4.325 | hole 0.7: -2.725,-1.75; -2.725,-1.25; 2.725,-1.75; 2.725,-1.25 | hole 0.65: -2.425,-4.73; -2.425,-4.33; 2.425,-4.73; 2.425,-4.33
0603-RES = smd 1.1 x 1: 1 -0.85,0; 2 0.85,0
FIDUCIA-MOUNT = smd 1.016 x 1.016: P$1 0,0
LED_550 = drill 1.02 square: ANODE 1.27,0; CATHODE -1.27,0
SWITCH_TACTILE = smd 3 x 1.2: P1 -2.375,1.85; P2 2.375,1.85; P3 -2.375,-1.85; P4 2.375,-1.85
RN4020SMD = smd 1.5 x 0.8: P01 0.25,10.9; P02 0.25,9.7; P03 0.25,8.5; P04 0.25,7.3; P05 0.25,6.1; P06 0.25,4.9; P07 0.25,3.7; P08 0.25,2.5; P17 11.25,2.5; P18 11.25,3.7; P19 11.25,4.9; P20 11.25,6.1; P21 11.25,7.3; P22 11.25,8.5; P23 11.25,9.7; P24 11.25,10.9 | smd 0.8 x 1.5: P10 2.75,0.25; P11 3.95,0.25; P12 5.15,0.25; P13 6.35,0.25; P14 7.55,0.25; P15 8.75,0.25
SOT23-5 = smd 0.55 x 1.2: 1 -0.95,-1.3; 2 0,-1.3; 3 0.95,-1.3; 4 0.95,1.3; 5 -0.95,1.3
1206 = smd 1.6 x 1.8: 1 -1.4,0; 2 1.4,0
SOT23 = smd 1 x 1.4: 1 -0.95,-1.1; 2 0.95,-1.1; 3 0,1.1
QFN44ML7X7 = smd 0.75 x 0.275: 1 -3.275,2.5; 2 -3.275,2; 3 -3.275,1.5; 4 -3.275,1; 5 -3.275,0.5; 6 -3.275,0; 7 -3.275,-0.5; 8 -3.275,-1; 9 -3.275,-1.5; 10 -3.275,-2; 11 -3.275,-2.5; 23 3.275,-2.5; 24 3.275,-2; 25 3.275,-1.5; 26 3.275,-1; 27 3.275,-0.5; 28 3.275,0; 29 3.275,0.5; 30 3.275,1; 31 3.275,1.5; 32 3.275,2; 33 3.275,2.5 | smd 0.275 x 0.75: 12 -2.5,-3.275; 13 -2,-3.275; 14 -1.5,-3.275; 15 -1,-3.275; 16 -0.5,-3.275; 17 0,-3.275; 18 0.5,-3.275; 19 1,-3.275; 20 1.5,-3.275; 21 2,-3.275; 22 2.5,-3.275; 34 2.5,3.275; 35 2,3.275; 36 1.5,3.275; 37 1,3.275; 38 0.5,3.275; 39 0,3.275; 40 -0.5,3.275; 41 -1,3.275; 42 -1.5,3.275; 43 -2,3.275; 44 -2.5,3.275 | smd 4.826 x 4.826: EXP 0,0
PUSHBUTTON = drill 0.9 square: C1 0,1.25; C2 0,-1.25; LS1 -2.5,1.25; LS2 -2.5,-1.25; RS1 2.5,1.25; RS2 2.5,-1.25 | drill 1.35 square: M1 -5.7,-2.1; M2 5.7,2.1
RHT03 = drill 0.65 square: P$1 -3.75,0; P$2 -1.25,0; P$3 1.25,0; P$4 3.75,0
TDFN33-14 = smd 1.65 x 2.5: GND_PAD 0,0 | smd 1.4 x 0.22: P$1 -1.7,1.2; P$2 -1.7,0.8; P$3 -1.7,0.4; P$4 -1.7,0; P$5 -1.7,-0.4; P$6 -1.7,-0.8; P$7 -1.7,-1.2; P$8 1.7,-1.2; P$9 1.7,-0.8; P$10 1.7,-0.4; P$11 1.7,0; P$12 1.7,0.4; P$13 1.7,0.8; P$14 1.7,1.2
WFDFN-10 = smd 0.9 x 2.6: MID_PAD 0,0 | smd 1 x 0.25: P$1 -1.35,1; P$2 -1.35,0.5; P$3 -1.35,0; P$4 -1.35,-0.5; P$5 -1.35,-1; P$6 1.35,-1; P$7 1.35,-0.5; P$8 1.35,0; P$9 1.35,0.5; P$10 1.35,1
CT/CN0603 = smd 1 x 1: 1 -1,0; 2 1,0
HC49UP = smd 5.334 x 1.93: 1 -4.826,0; 2 4.826,0
0402 = smd 0.7 x 0.9: 1 -0.65,0; 2 0.65,0
0805 = smd 0.8 x 1.2: 1 -0.9,0; 2 0.9,0
1210 = smd 1.2 x 2: 1 -1.6,0; 2 1.6,0
2917_CAP = smd 2.77 x 2.55: T+ 3.22,0; T- -3.22,0

### Placement (x,y rotation side)
3_3V_FAN_COPOL  4.5,74 0 top
ATMEGA32U4-T  60.01,22.99 0 top
BT_C1  54,49 90 top
BT_C2  51,40.5 180 top
CA_FB1  11.5,20 180 top
CD_C1  59,61 270 top
CE_C1  15.9,12.2 225 top
CON_BAT  22,34 0 top
CON_DUST  75.02,6.7 180 top
CON_EXTERN  5.3,14.75 90 top
CON_FAN  32.5,5.5 0 top
CON_ICSP  42.9,16.2 90 top
CON_USB  0.48,45.97 90 top
CONHEADER_FAN  4.5,73.5 0 top
CTH_C1  80,11 180 top
CTH_R1  52,55 90 top
DUST_SENSOR  4.5,75 0 top
FID1  2.92,38.02 0 top
FID2  71.4,64.64 0 top
FID3  87.26,14.72 0 top
LED_BT  65.41,70.8 0 top
LED_CH  7.62,55.24 90 top
LION_BATTERY  4.5,74.5 0 top
R_LED_BT  60.5,70 90 top
R_LED_CH  12.5,57.5 90 top
RESET_SWITCH  45.5,7.5 180 top
U$1  63.5,58 270 top
U$6  [EAGLE_FREESPACE]  0,0 0 top
U_BT_RX  54.59,45.18 270 top
U_BT_TX  56.41,38.82 90 top
U_C1  30.5,57.5 90 top
U_C3  12,49 0 top
U_C4  16.5,54.5 90 top
U_FANM  34,12 180 top
U_FB1  16,39 90 top
U_FB2  74,20 180 top
U_FB3  8,49 90 top
U_MEGA32U-Q  60.01,22.99 0 top
U_PUSHB  36.2,58.14 90 top
U_R1  32,40.5 270 top
U_R2  32,36.5 270 top
U_TEMP-HUM  50.16,62.6 180 top
U_USB_CH  20.5,53 0 top
U_VR3  22,20.5 0 top
U_VR5  23.5,7.5 90 top
U_Z1  30,36.5 270 top
U_Z2  30,40.5 270 top
U_Z3  11,11 0 top
U_Z4  11,13 0 top
U_Z5  11,15 0 top
U_Z6  14.6,13.5 225 top
UC_C1  53.2,31 90 top
UC_C2  54.9,13.5 270 top
UC_C3  57.5,13 0 top
UC_C4  61.5,13 180 top
UC_C5  70.5,19 270 top
UC_C6  58.5,31.5 0 top
UC_C7  50,23 180 top
UC_C8  69.5,31 270 top
UC_CRYSTAL  59.5,9 180 top
UC_NTC  31.5,52 270 top
UC_R1  59.5,15.2 180 top
UC_R2  50.3,13 90 top
UC_R3  47,27 90 top
UC_R4  66,29.5 270 top
UC_R6  31.5,48.5 270 top
UR_C1  26,52.5 270 top
UR_C2  29.5,54 270 top
VR3_0R1  32,21 180 top
VR3_0R2  32,18.9 180 top
VR3_C1  20.5,17 270 top
VR3_C2  21.5,24.5 0 top
VR3_C3  21.5,23 0 top
VR3_L1  18,20.5 270 top
VR3_R1  26,27 0 top
VR3_R2  28.5,17 270 top
VR3_R4  29,47.5 270 top
VR3_R5  15.5,58.5 180 top
VR5_0R1  15,19.5 270 top
VR5_0R2  17,16.5 180 top
VR5_C1  26.5,6 0 top
VR5_C2  20.5,6.5 90 top
VR5_C3  18.5,6.5 90 top
VR5_C4  21.5,12 180 top
VR5_L1  23.5,3.5 0 top
VR5_R1  27.38,2.92 90 top
VR5_R2  28,10.5 270 top
VR_C1  40,47 180 top
VR_R2  29.5,30 180 top
VR_R4  31,12 270 top

### Tracks (layer width: path | path; a pad name or v marks a point on that pad's centre or on a via)
+3V3  (via drill 0.6)
  Top 0.2: VR3_C3.1 20.6,21.55 U_VR3.P$1
  Top 0.305: U$1.P07 67.2,60.31 65.02,62.48 63.02,62.48 v63,62.5 | U$1.P15 62.75,49.25 v60.5,47
  Top 0.4: 33,13.15 U_FANM.2 32.8,12.85 | VR3_C2.1 20.6,25.6 22,27
  Top 0.406: VR3_R1.1 22,27
  Top 0.6: VR_R4.1 32.8,12.85 | v34,23 34,15.5 33,14.5 33,13.15
  Top 0.61: 67.31,57.86 U$1.P07 | U$1.P23 73.2,45.01 72.9,44.7 62.8,44.7 v60.5,47
  Top 0.8: v60.5,47 59.63,46.13 U_BT_RX.5 54.51,47.5 54,47.5 | v32.5,43 45.5,43 50,47.5 54,47.5 | BT_C1.1 54,47.5 | CON_EXTERN.T_3 CON_EXTERN.B_3 9.75,14.75 U_Z5.1
  Bottom 0.305: v60.5,47 60.5,60 v63,62.5
  Bottom 0.4: v34,23 31,26 31,27.5 32.5,29
  Bottom 0.8: 32.5,29 v32.5,43 | v17.5,24 17.5,17.5 14.75,14.75 CON_EXTERN.B_3
  other vias: 19,24
  pour Bottom: 17,30 17,23 19,23 23,27 28.5,27 29.5,26 29.5,25 32.5,25 32.5,30
  pour Top (isolate 0.3, no thermals): 17,25 17,23 20,23 20,21.5 21,21.5 21,25
+5V  (via drill 0.6)
  Top 0.2: U_MEGA32U-Q.2 56.11,24.99 54.9,26.2 ATMEGA32U4-T.2 | U_MEGA32U-Q.34 62.51,26.31 | U_MEGA32U-Q.14 58.51,18.81 57.6,17.9 ATMEGA32U4-T.14
  Top 0.3: 27.5,1.5 20.5,1.5 20,2
  Top 0.32: 21.95,5.6 U_VR5.P$1
  Top 0.4: 62.51,26.31 64.01,27.81 ATMEGA32U4-T.34 64,31 65,32 | ATMEGA32U4-T.2 53.3,26.2 53,26.5 v53,28.5 53.2,28.7 UC_C1.1 | CON_ICSP.2 41.63,12.37 42.5,11.5 45,11.5 46.5,13 49,13 49.85,13.85 UC_R2.2 50.45,14 51,14 51.5,14.5 55,14.5 | ATMEGA32U4-T.14 57.6,15.6 v56.5,14.5 55,14.5 | 54.87,37.87 U_BT_TX.5 54.99,38 v53,38 52,39 52,40.5 BT_C2.1 | UC_C8.1 69.5,32 | UC_C2.1 55,14.45 55,14.5 | U_FB2.P$1 78,20 | CTH_R1.1 52,53 v53,52 | 16.4,13.1 16.5,13
  Top 0.406: CD_C1.1 54.66,61.85 U_TEMP-HUM.P$1 | U_Z6.1 15.31,14.19 15.5,14 | CE_C1.1 16.5,13
  Top 0.8: 65,32 69.5,32 73.5,32 78.5,27 | 17.5,9.5 17.5,12 16.5,13 15.5,14 14,15.5 14,16.5 13,17.5 8.05,17.5 CON_EXTERN.B_4 CON_EXTERN.T_4 | VR5_C2.1 21.95,5.6
  Bottom 0.4: v53,28.5 v53,38 53,49.5 | v53,52 53,61.68 U_TEMP-HUM.P$1
  Bottom 0.406: 53,49.5 v53,52
  Bottom 0.8: v53,28.5 54.5,27 54.5,18 56.5,16 v56.5,14.5
  other vias: 56.5,5 54,5
  pour Top (isolate 0.3, rank 3): 17,10 17,0 83.5,0 83.5,30.5 77.5,30.5 77.5,9 69,9 69,6 51,6 51,4 21,4 21,6 18,6 18,10
  pour Bottom: 53,4 53,15 57.5,15 57.5,12.5 56,12.5 56,10.5 57.5,10.5 57.5,4
  pour Top (isolate 0.3, rank 2, no thermals): 17.28,4.42 22.78,4.42 22.78,6.42 17.28,6.42
A0/DUST_DETECT  (via drill 0.6)
  Top 0.2: U_MEGA32U-Q.36 61.51,27.21 62.4,28.1 ATMEGA32U4-T.36
  Top 0.4: v76,34.5 62.5,34.5 62.41,34.41 ATMEGA32U4-T.36
  Bottom 0.4: CON_DUST.P$2 76.27,7.23 76,7.5 v76,34.5
A1  (via drill 0.6)
  Top 0.2: U_MEGA32U-Q.37 61.01,27.51 61.6,28.1 ATMEGA32U4-T.37
  Top 0.4: 39.5,35.5 61.5,35.5 61.61,35.39 ATMEGA32U4-T.37
  Top 0.406: v39,36 39.5,35.5
  Top 0.8: CON_EXTERN.T_1 CON_EXTERN.B_1 8.75,9.75 U_Z3.1
  Bottom 0.4: v39,36 39,19 32,12 11,12 8.75,9.75 CON_EXTERN.B_1
A2
  Top 0.2: U_MEGA32U-Q.38 60.51,27.81 60.8,28.1 ATMEGA32U4-T.38
A3
  Top 0.2: U_MEGA32U-Q.39 ATMEGA32U4-T.39
A4
  Top 0.2: U_MEGA32U-Q.40 59.51,27.79 59.2,28.1 ATMEGA32U4-T.40
A5
  Top 0.2: U_MEGA32U-Q.41 59.01,27.49 58.4,28.1 ATMEGA32U4-T.41
AREF
  Top 0.2: U_MEGA32U-Q.42 58.51,27.19 57.6,28.1 ATMEGA32U4-T.42
  Top 0.4: ATMEGA32U4-T.42 57.61,31.39 57.5,31.5 57.5,31.35 UC_C6.1
AVCC  (via drill 0.6)
  Top 0.2: U_MEGA32U-Q.44 57.51,26.29 56,27.8 ATMEGA32U4-T.44 | U_MEGA32U-Q.24 63.91,20.99 65.1,19.8 ATMEGA32U4-T.24
  Top 0.4: ATMEGA32U4-T.24 68,19.8 | 68,19.8 v68,18.5 | v55.5,31.5 56,31 ATMEGA32U4-T.44 | 68,19.8 70.45,19.8 UC_C5.1 72.75,19.85 U_FB2.P$2
  Bottom 0.4: v68,18.5 63.5,18.5 56,26 56,31 v55.5,31.5
BT_RX  (via drill 0.6)
  Top 0.305: U_BT_RX.4 58.64,44.23 v58.67,44.2 | U$1.P06 68.4,62.41 v68.07,62.74
  Bottom 0.305: v58.67,44.2 62.48,44.2 63.75,45.47 63.75,59.94 66.55,62.74 v68.07,62.74
BT_TX  (via drill 0.6)
  Top 0.305: U$1.P05 69.6,60.96 70.1,61.47 v71.12,61.47
  Top 0.4: U_BT_TX.2 61.82,38.82 63.03,40.03
  Top 0.406: 63.03,40.03 63.03,41.95 64.01,42.93 v66.8,42.93
  Bottom 0.305: v66.8,42.93 66.8,46.99 65.02,48.77 65.02,58.93 67.56,61.47 v71.12,61.47
D0/RX
  Top 0.2: U_MEGA32U-Q.20 61.51,18.79 62.4,17.9 ATMEGA32U4-T.20
D1/TX
  Top 0.2: U_MEGA32U-Q.21 62.01,19.09 63.2,17.9 ATMEGA32U4-T.21
D2/SDA
  Top 0.2: U_MEGA32U-Q.19 61.01,18.49 61.6,17.9 ATMEGA32U4-T.19
D3/SCL
  Top 0.2: U_MEGA32U-Q.18 60.51,18.19 60.8,17.9 ATMEGA32U4-T.18
D4
  Top 0.2: U_MEGA32U-Q.25 64.21,21.49 65.1,20.6 ATMEGA32U4-T.25
D5*/FAN_CONTROL  (via drill 0.6)
  Top 0.2: U_MEGA32U-Q.31 64.19,24.49 65.1,25.4 ATMEGA32U4-T.31
  Top 0.4: ATMEGA32U4-T.31 71.61,25.39 v72.5,24.5 | v72.5,36 62,36 61.5,36.5 v42,36.5 | v40.5,22 35.5,17 35.5,13.65 U_FANM.1
  Bottom 0.4: v72.5,24.5 v72.5,36 | v42,36.5 42,23.5 v40.5,22
D6*
  Top 0.2: U_MEGA32U-Q.27 64.81,22.49 65.1,22.2 ATMEGA32U4-T.27
D7
  Top 0.2: U_MEGA32U-Q.1 56.71,25.49 55.2,27 ATMEGA32U4-T.1
D+
  Top 0.4: CON_USB.T3 12.53,45.97 13.5,45 14.5,44 17.5,44 19,42.5 21,40.5 26.5,40.5 28,39 28,38 28.5,37.5 U_Z1.1 31.85,37.5 U_R2.1
D-
  Top 0.4: CON_USB.T2 13.88,46.62 14.5,46 15.5,45 18.5,45 20.5,43 21.5,42 29.5,42 U_Z2.1 31.85,41.5 U_R1.1
GND  (via drill 0.5, 0.6)
  Top 0.2: ATMEGA32U4-T.P$1 58.01,24.99 U_MEGA32U-Q.43 58.01,26.89 56.8,28.1 ATMEGA32U4-T.43 | 63.2,28.62 63.2,28.1 62.01,26.91 U_MEGA32U-Q.35 62.01,24.99 ATMEGA32U4-T.P$1 | 63.2,28.62 ATMEGA32U4-T.35 | U_MEGA32U-Q.23 63.31,20.49 64.8,19 ATMEGA32U4-T.23 | 58.4,17.28 58.4,17.9 59.01,18.51 U_MEGA32U-Q.15 59.01,21.99 ATMEGA32U4-T.P$1 | 58.4,17.28 ATMEGA32U4-T.15 | ATMEGA32U4-T.15 58.41,17.27 58.4,17.28 | U_VR5.P$3 U_VR5.MID_PAD 23,8 U_VR5.P$9 | CON_USB.BPBR 1.73,43.62 CON_USB.PBR 3.42,43.25 CON_USB.PBR2 | CON_USB.BPBL 1.73,48.32 CON_USB.PBL 3.42,48.7 CON_USB.PBL2 | ATMEGA32U4-T.35 63.21,28.63 63.2,28.62 | U_VR3.P$3 U_VR3.MID_PAD 22.5,21 U_VR3.P$9 | U_USB_CH.P$4 U_USB_CH.GND_PAD
  Top 0.4: ATMEGA32U4-T.35 63.21,31.71 64,32.5
  Top 0.406: CTH_C1.2 79.15,7.08 CON_DUST.P$1
  Top 0.8: CON_USB.PTR 3.77,43.07 CON_USB.PBR2
  other vias: 30.5,17 24.5,7.5 22.5,7.5 24.5,25.5 22,16 28.5,40.5 31,23 28,8 57,11.5 68,27.5 59.36,32.9 24.5,24 20.5,9 22,19.5 22,21.5 19.5,10.5 25.5,9 2.5,22.5 44.5,63.5 56,63 60,63.5 67.5,51.5 66.5,38.5 64,38 73,14.5 67,13.5 71,11.5 37.5,7 38.5,11.5 43.5,22.5 44.5,28.5 48.5,43 43.5,40.5 55.5,42.5 63.5,33 2.5,25.5 2.5,29 2.5,32 25.5,39 30,34 27.5,35.5 20.5,48.5 20.5,50.5 20.5,55.5 16,60.5 16.5,57 20.5,46.5 14.5,57 20,57.5 18.5,48.5 27,46.5 28,51.5 25,46.5 15.5,10 13.5,10.5 17.27,31.99 13.46,18.54
  pour Top (isolate 0.5, rank 6): 0,0 0,80.5 58.5,80.5 103,80.5 103,0
  pour Bottom (isolate 0.5, rank 6): 0,0.5 0,81 58.5,81 103,81 103,0.5
  pour Top (isolate 0.3, rank 2, no thermals): 21,23 21,19 23,19 23,22 24,22 24,23.5 21,23.5
  pour Top (isolate 0.3, no thermals): 18.28,6.42 25.28,6.42 25.28,8.42 22.28,8.42 22.28,9.42 18.28,9.42
  pour Top (isolate 0.3, rank 2, no thermals): 19.5,55 19.5,50.5 21.5,50.5 21.5,55
HWB
  Top 0.2: U_MEGA32U-Q.33 64.8,27 ATMEGA32U4-T.33
  Top 0.4: ATMEGA32U4-T.33 65.8,28.45 UC_R4.2
IO8
  Top 0.2: U_MEGA32U-Q.28 ATMEGA32U4-T.28
IO9*/TH_DETECT  (via drill 0.6)
  Top 0.2: U_MEGA32U-Q.29 64.79,23.49 65.1,23.8 ATMEGA32U4-T.29
  Top 0.305: 52,56.5 58.79,56.5 61.72,59.44 61.72,63.25 62.48,64.01 68.58,64.01 69.85,62.74 71.88,62.74 73.15,61.47 73.15,60.2
  Top 0.4: ATMEGA32U4-T.29 67.21,23.79 68,23 v71,23 | CTH_R1.2 52,56.5 51.41,57.09 U_TEMP-HUM.P$2
  Top 0.406: 73.15,60.2 v73.03,60.08
  Bottom 0.406: v71,23 71,58.05 v73.03,60.08
IO10*/BT_TX  (via drill 0.6)
  Top 0.2: U_MEGA32U-Q.30 64.49,23.99 65.1,24.6 ATMEGA32U4-T.30
  Top 0.4: ATMEGA32U4-T.30 69.09,24.59 69.41,24.59 v69.5,24.5 | v69.5,41 v64.5,41 | v61.5,41 55.5,41 55,40.5 55,39.89 U_BT_TX.4
  Bottom 0.4: v69.5,24.5 v69.5,41 | v64.5,41 v61.5,41
IO11*/BT_RX  (via drill 0.6)
  Top 0.2: U_MEGA32U-Q.12 57.51,19.41 56,17.9 | U_BT_RX.2 53.26,45.18 53.08,45 v51.5,45
  Top 0.4: 56,17.9 ATMEGA32U4-T.12 55.32,16.5 v54,16.5
  Bottom 0.4: v54,16.5 51.5,19 v51.5,45
IO12
  Top 0.2: U_MEGA32U-Q.26 64.51,21.99 65.1,21.4 ATMEGA32U4-T.26
IO13*/BT_LED  (via drill 0.6)
  Top 0.2: U_MEGA32U-Q.32 63.89,24.99 65.1,26.2 ATMEGA32U4-T.32
  Top 0.4: ATMEGA32U4-T.32 72.7,26.2 v74.5,28
  Bottom 0.4: v74.5,28 74.5,62.98 LED_BT.ANODE
MISO
  Top 0.2: U_MEGA32U-Q.11 56.69,20.49 55.2,19
  Top 0.4: 55.2,19 ATMEGA32U4-T.11 54,18.78 52.78,18.78 50,16 47,16 44.66,13.66 CON_ICSP.1
MOSI
  Top 0.2: U_MEGA32U-Q.10 56.09,20.99 54.9,19.8
  Top 0.4: 54.9,19.8 ATMEGA32U4-T.10 | ATMEGA32U4-T.10 | ATMEGA32U4-T.10 52.3,19.8 49.5,17 47,17 45,15 42.83,15 CON_ICSP.4
N$1
  Top 0.3: U_VR3.P$2 19.1,21
  Top 0.4: 19.1,21 VR3_L1.1
N$2  (via drill 0.6)
  Top 0.2: U_USB_CH.P$10 23.1,52.6 23.5,52.2 23.5,51.5 v24.5,50.5 | v27.5,48.5 28.85,48.5 VR3_R4.1
  Bottom 0.2: v24.5,50.5 26.5,48.5 v27.5,48.5
N$3
  Top 0.2: LED_BT.CATHODE 60.55,70.8 R_LED_BT.2
N$4  (via drill 0.6)
  Top 0.3: VR3_R2.1 v28.5,23 25.5,23 24,21.5 U_VR3.P$10 | VR3_R1.2 v28.5,27
  Bottom 0.4: v28.5,27 v28.5,23
N$5  (via drill 0.6)
  Top 0.2: U_USB_CH.P$11 23.5,53 v24.5,52
  Top 0.4: UC_R6.1 31.5,50 | 31.5,50 UC_NTC.2 | v30,50 31.5,50
  Bottom 0.2: v30,50 26.5,50 v24.5,52
N$6
  Top 0.2: U_USB_CH.P$14 22.2,54.7 23.5,56 29.85,56 U_C1.1
N$7
  Top 0.8: CON_EXTERN.T_5 CON_EXTERN.B_5 10.15,19.75 CA_FB1.P$2
N$8  (via drill 0.6)
  Top 0.2: U_USB_CH.P$3 17.9,53.4 v16.5,52
  Top 0.4: v11.5,53.5 11.5,55.65 R_LED_CH.1
  Bottom 0.4: v16.5,52 13,52 v11.5,53.5
N$9
  Top 0.3: U_VR3.P$4 19.1,20
  Top 0.4: 19.1,20 VR3_L1.2
N$10  (via drill 0.6)
  Top 0.2: U_VR5.P$10 v22.5,10.5
  Top 0.4: VR5_R2.1 28.15,11.5 29,11.5 29.5,11 v29.5,10.5 29.5,4.66 28.61,3.77 VR5_R1.2
  Bottom 0.4: v22.5,10.5 v29.5,10.5
N$11
  Top 0.3: U_VR5.P$2 23,4.6
  Top 0.4: 23,4.6 VR5_L1.1
N$12
  Top 0.3: U_VR5.P$4 24,4.6
  Top 0.4: 24,4.6 VR5_L1.2
N$14
  Top 0.406: LED_CH.CATHODE 7.64,54 8.5,54 9.5,55 9.5,56 11.85,58.35 R_LED_CH.2
N$15
  Top 0.2: U_USB_CH.P$1 18.8,57.2 17.5,58.5 VR3_R5.1
RD+
  Top 0.2: U_MEGA32U-Q.4 55.51,23.99 54.9,24.6 ATMEGA32U4-T.4
  Top 0.4: ATMEGA32U4-T.4 52.9,24.6 49.5,28 48.5,29 48.5,30.5 46.5,32.5 33,32.5
  Top 0.406: 33,32.5 32,33.5 U_R2.2
RD-  (via drill 0.6)
  Top 0.2: U_MEGA32U-Q.3 55.81,24.49 54.9,25.4 ATMEGA32U4-T.3
  Top 0.4: ATMEGA32U4-T.3 53.1,25.4 51,27.5 | U_R1.2 32,39.5 34.15,39.5
  Top 0.406: 51,27.5 50,28.5 v50,31.5 | 34.15,39.5 35.15,38.5 v50,38.5
  Bottom 0.4: v50,38.5 v50,31.5
RESET  (via drill 0.6)
  Top 0.2: U_MEGA32U-Q.13 58.01,19.11 56.8,17.9 | CON_ICSP.5 44.24,18.74 44.5,19
  Top 0.4: 56.8,17.9 ATMEGA32U4-T.13 56.81,15.81 56.5,15.5 51,15.5 50.5,15 48,15 v47.5,14.5 | RESET_SWITCH.P4 RESET_SWITCH.P3 48,9.47 v48,11 49.15,11 UC_R2.1
  Bottom 0.4: CON_ICSP.5 44.41,18.5 46.5,18.5 47.5,17.5 v47.5,14.5 48,14 v48,11
RXLED
  Top 0.2: U_MEGA32U-Q.8 55.49,21.99 54.9,21.4 ATMEGA32U4-T.8
SCK
  Top 0.2: U_MEGA32U-Q.9 55.79,21.49 54.9,20.6
  Top 0.4: 54.9,20.6 ATMEGA32U4-T.9 52.41,20.59 52.32,20.5 51.5,20.5 49,18 46.5,18 44.7,16.2 CON_ICSP.3
TXLED
  Top 0.2: U_MEGA32U-Q.22 62.51,19.69 64,18.2 ATMEGA32U4-T.22
UCAP
  Top 0.2: U_MEGA32U-Q.6 ATMEGA32U4-T.6 UC_C7.1
UGND  (via drill 0.6)
  Top 0.2: U_MEGA32U-Q.5 55.21,23.49 54.9,23.8 ATMEGA32U4-T.5
  Top 0.4: ATMEGA32U4-T.5 52.7,23.8 51,25.5 | 51,25.5 49,27.5 47.35,27.5 UC_R3.2 47,29.5 45,31.5 31,31.5 | UC_C7.2 49.15,23.65 51,25.5
  Top 0.406: CON_USB.T5 6.67,44.67 7,45 12,45 15,42 | v30.5,32 31,31.5
  Bottom 0.4: v16.5,41.5 18,40 18,33.5 19.5,32 v30.5,32
  other vias: 16.5,43
  pour Top (isolate 0.3): 3.5,46 3.5,44.5 6,44.5 6,39.5 17.5,39.5 17.5,46
V_BAT  (via drill 0.6)
  Top 0.2: U_USB_CH.P$12 24,53.4 | 26.1,53.5 UR_C1.1 | U_USB_CH.P$8 22.7,51.8 23,51.5 23,50.5 v24.5,49
  Top 0.4: 24,53.4 UR_C1.1
  Top 0.8: CON_BAT.2 v23,34 | v27.5,53.5 26.1,53.5
  Bottom 0.8: v23,34 23,49 | v24.5,49 23,49 | 23,49 22,50 22,52.4 23,53.4 27.4,53.4 v27.5,53.5
VEN  (via drill 0.6)
  Top 0.3: v26.5,24 27,24.5 31,24.5 31.95,25.45 31.95,29.95 | U_VR3.P$6 25,19.5 v26.5,18 26.5,16.5 25.5,15.5 25.5,13.5 24.5,12.5 U_VR5.P$6
  Top 0.4: 31.95,29.95 32,30
  Top 0.406: v40.5,30 32,30 VR_R2.1
  Bottom 0.3: v26.5,24 v26.5,18
  Bottom 0.4: v40.5,30 40.5,57 39.36,58.14 U_PUSHB.C2 U_PUSHB.C1
VFAN
  Top 0.2: 31.25,10.9 VR_R4.2
  Top 0.4: 33.75,11.15 U_FANM.3
  Top 0.406: 31.25,10.9 31.25,8.3 CON_FAN.P1
  Top 0.8: 33.75,11.15 VR_R4.2 31.25,10.9
VR3_PS  (via drill 0.6)
  Top 0.2: VR3_0R1.2 v29.5,21
  Top 0.3: VR3_0R1.2 VR3_0R2.2 | v27.5,21 26.5,20 U_VR3.P$7
  Bottom 0.3: v29.5,21 v27.5,21
VR5_PS  (via drill 0.6)
  Top 0.3: v24,14 24,10.5 U_VR5.P$7 | 19,15.5 v20.5,14
  Top 0.4: VR5_0R1.2 15,17.65 VR5_0R2.2 16.15,15.85 16.5,15.5 19,15.5
  Bottom 0.4: v24,14 v20.5,14
VREG_IN  (via drill 0.6)
  Top 0.2: U_USB_CH.P$13 23.3,53.8 24.5,55 | 20.6,18 VR3_C1.1
  Top 0.3: U_VR5.P$5 25.45,6.15 VR5_C1.1 26.5,6.9 v26.5,14.5 31,14.5 32.85,16.35 VR3_0R2.1 | v25,21 24.5,20.5 U_VR3.P$8 | U_VR5.P$8 23.5,12 22.5,12 | 22.5,13 22.5,12 | 22.5,12 VR5_C4.1 | U_VR3.P$5 20.65,18.05
  Top 0.4: VR5_0R2.1 18.35,17 19,17 19.9,17.9 VR3_C1.1 | 20.65,18.05 VR3_C1.1 | 20.9,17.5 VR3_C1.1
  Top 0.8: 20.9,17.5 v24.5,17.5 24.5,16.5 22.5,14.5 22.5,13 | 24.5,55 29.4,55 UR_C2.1 29.9,54.9 30,55 34.25,55 34.89,55.64 U_PUSHB.LS1
  Bottom 0.2: v25,21 25,18 v24.5,17.5 24.5,16.5 v26.5,14.5
  pour Bottom (isolate 0.3, rank 2): 24,21.5 24,13 31.5,13 37.5,19 37.5,56.5 34,56.5 34,18.5 31,15.5 26,15.5 26,21.5
  pour Top (isolate 0.2): 22,13 22,11.5 23.5,11.5 23.5,13
  pour Top (isolate 0.3): 34,56.5 34,53 35,52 35,46 39,46 39,56.5
VUSB  (via drill 0.6)  (1 unrouted)
  Top 0.2: U_USB_CH.P$2 15.3,53.8 | U_MEGA32U-Q.7 55.19,22.49 54.9,22.2 ATMEGA32U4-T.7 | 17,50.5 18.3,51.8 U_USB_CH.P$7 U_USB_CH.P$6
  Top 0.4: 15.3,53.8 15,53.5 15,50.5 | ATMEGA32U4-T.7 52.2,22.2 51.5,21.5 v47.5,21.5 | v47.5,47.5 44.5,44.5 31.5,44.5 | 31.5,44.5 20.5,44.5 19,46 15.77,46 14.5,47.27 10.6,47.27 U_C3.1 | 17,50.5 15,50.5 | LED_CH.ANODE 7.01,56.52 6,55.5 6,51.5 7.4,50.1 U_FB3.P$2 9.1,49 U_C3.1 | 15,50.5 10.9,50.5 10.6,50.2 U_C3.1 | UC_R6.2 31.5,44.5
  Top 0.813: CON_EXTERN.T_2 CON_EXTERN.B_2
  Bottom 0.4: v47.5,21.5 v47.5,47.5
  Bottom 0.61: CON_EXTERN.B_2 6.55,12.25 5.59,13.21 5.59,20.57 6.35,21.34 14.22,21.34 16,23.11 16,39.88 14.99,40.89 14.99,46.99 9.65,52.32 9.65,56.64 7.75,56.64 LED_CH.ANODE
  pour Top (isolate 0.3, rank 2): 8.5,51 8.5,47 12,47 12,50 17.5,50 17.5,54.5 14.5,54.5 14.5,51
XTAL1
  Top 0.2: U_MEGA32U-Q.17 ATMEGA32U4-T.17 | 62,9 UC_CRYSTAL.1
  Top 0.4: ATMEGA32U4-T.17 60.01,15.54 UC_R1.1 60.35,13.3 UC_C4.2 60.65,10.35 62,9
XTAL2
  Top 0.2: U_MEGA32U-Q.16 59.51,18.21 59.2,17.9 ATMEGA32U4-T.16 | 57,9 UC_CRYSTAL.2
  Top 0.4: ATMEGA32U4-T.16 59.21,15.76 UC_R1.2 58.65,13.3 UC_C3.2 58.35,10.35 57,9
XUSB
  Top 0.4: CON_USB.T1 7.37,47.27 U_FB3.P$1

### Text on the board
tPlace: -
tNames: Airbeam | v1.0
Document: GND | 5V | 3.3V | A2 | A1
ReferenceLS: Offboard Parts